# Altium project Y-Axis Driver.PrjPcb
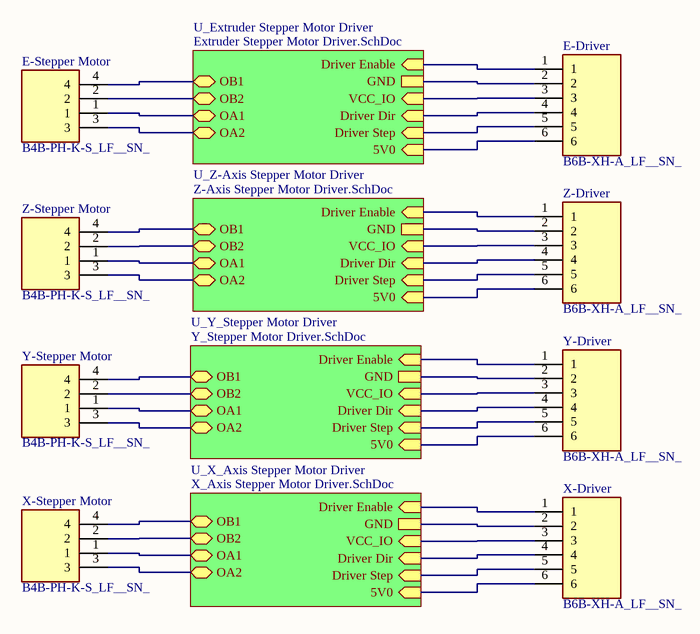
[diagram p0: Stepper Motor Driver Board.SchDoc]
4 sheets, 92 parts. Net scope: hierarchical (ports join the sheet entries above them; power ports are global).
Board file: Axis Driver PCB.PcbDoc
Sheets:
  Stepper Motor Driver Board.SchDoc
    U_X_Axis Stepper Motor Driver = X_Axis Stepper Motor Driver.SchDoc
    U_Z-Axis Stepper Motor Driver = Z-Axis Stepper Motor Driver.SchDoc
    U_Extruder Stepper Motor Driver = Extruder Stepper Motor Driver.SchDoc

## Sheet Stepper Motor Driver Board.SchDoc
size A; SheetNumber: 1; SheetTotal: 5

### Parts
E-Driver  B6B-XH-A_LF__SN_  [SHDR6W64P0X250_1X6_1740X575X700P]
E-Stepper_Motor  B4B-PH-K-S_LF__SN_  [SHDR4W50P0X200_1X4_990X450X600P]
X-Driver  B6B-XH-A_LF__SN_  [SHDR6W64P0X250_1X6_1740X575X700P]
X-Stepper_Motor  B4B-PH-K-S_LF__SN_  [SHDR4W50P0X200_1X4_990X450X600P]
Y-Driver  B6B-XH-A_LF__SN_  [SHDR6W64P0X250_1X6_1740X575X700P]
Y-Stepper_Motor  B4B-PH-K-S_LF__SN_  [SHDR4W50P0X200_1X4_990X450X600P]
Z-Driver  B6B-XH-A_LF__SN_  [SHDR6W64P0X250_1X6_1740X575X700P]
Z-Stepper_Motor  B4B-PH-K-S_LF__SN_  [SHDR4W50P0X200_1X4_990X450X600P]

### Sub-sheets
U_Extruder Stepper Motor Driver = Extruder Stepper Motor Driver.SchDoc: Driver Dir (in), Driver Step (in), Driver Enable (in), 5V0 (in), OB1 (bidir), OB2 (bidir), OA1 (bidir), OA2 (bidir), VCC_IO (in), GND
U_X_Axis Stepper Motor Driver = X_Axis Stepper Motor Driver.SchDoc: Driver Dir (in), Driver Step (in), Driver Enable (in), 5V0 (in), OB1 (bidir), OB2 (bidir), OA1 (bidir), OA2 (bidir), VCC_IO (in), GND
U_Y_Stepper Motor Driver = Y_Stepper Motor Driver.SchDoc (file not in this document): Driver Dir (in), Driver Step (in), Driver Enable (in), 5V0 (in), OB1 (bidir), OB2 (bidir), OA1 (bidir), OA2 (bidir), VCC_IO (in), GND
U_Z-Axis Stepper Motor Driver = Z-Axis Stepper Motor Driver.SchDoc: Driver Dir (in), Driver Step (in), Driver Enable (in), 5V0 (in), OB1 (bidir), OB2 (bidir), OA1 (bidir), OA2 (bidir), VCC_IO (in), GND

### Nets
Net0.47nF_X_1: X-Driver.6 ; sheet U_X_Axis Stepper Motor Driver/5V0
Net0.47nF_X_2: X-Driver.2 ; sheet U_X_Axis Stepper Motor Driver/GND
Net0.47nF_Z_1: Z-Driver.6 ; sheet U_Z-Axis Stepper Motor Driver/5V0
Net0.47nF_Z_2: Z-Driver.2 ; sheet U_Z-Axis Stepper Motor Driver/GND
Net0.47uF_E_1: E-Driver.6 ; sheet U_Extruder Stepper Motor Driver/5V0
Net0.47uF_E_2: E-Driver.2 ; sheet U_Extruder Stepper Motor Driver/GND
Net10k_Dr_Enb_E_2: E-Driver.1 ; sheet U_Extruder Stepper Motor Driver/Driver Enable
Net10k_Dr_Enb_X_2: X-Driver.1 ; sheet U_X_Axis Stepper Motor Driver/Driver Enable
Net10k_Dr_Enb_Z_2: Z-Driver.1 ; sheet U_Z-Axis Stepper Motor Driver/Driver Enable
Net100nF_1_E_2: E-Driver.3 ; sheet U_Extruder Stepper Motor Driver/VCC_IO
Net100nF_1_X_2: X-Driver.3 ; sheet U_X_Axis Stepper Motor Driver/VCC_IO
Net100nF_1_Z_2: Z-Driver.3 ; sheet U_Z-Axis Stepper Motor Driver/VCC_IO
NetE-Axis_SMIC_8: E-Driver.5 ; sheet U_Extruder Stepper Motor Driver/Driver Step
NetE-Axis_SMIC_9: E-Driver.4 ; sheet U_Extruder Stepper Motor Driver/Driver Dir
NetE-Axis_SMIC_15: E-Stepper_Motor.4 ; sheet U_Extruder Stepper Motor Driver/OB1
NetE-Axis_SMIC_19: E-Stepper_Motor.2 ; sheet U_Extruder Stepper Motor Driver/OB2
NetE-Axis_SMIC_42: E-Stepper_Motor.3 ; sheet U_Extruder Stepper Motor Driver/OA2
NetE-Axis_SMIC_46: E-Stepper_Motor.1 ; sheet U_Extruder Stepper Motor Driver/OA1
NetX-Axis_SMIC_8: X-Driver.5 ; sheet U_X_Axis Stepper Motor Driver/Driver Step
NetX-Axis_SMIC_9: X-Driver.4 ; sheet U_X_Axis Stepper Motor Driver/Driver Dir
NetX-Axis_SMIC_15: X-Stepper_Motor.4 ; sheet U_X_Axis Stepper Motor Driver/OB1
NetX-Axis_SMIC_19: X-Stepper_Motor.2 ; sheet U_X_Axis Stepper Motor Driver/OB2
NetX-Axis_SMIC_42: X-Stepper_Motor.3 ; sheet U_X_Axis Stepper Motor Driver/OA2
NetX-Axis_SMIC_46: X-Stepper_Motor.1 ; sheet U_X_Axis Stepper Motor Driver/OA1
NetY-Driver_1: Y-Driver.1 ; sheet U_Y_Stepper Motor Driver/Driver Enable
NetY-Driver_2: Y-Driver.2 ; sheet U_Y_Stepper Motor Driver/GND
NetY-Driver_3: Y-Driver.3 ; sheet U_Y_Stepper Motor Driver/VCC_IO
NetY-Driver_4: Y-Driver.4 ; sheet U_Y_Stepper Motor Driver/Driver Dir
NetY-Driver_5: Y-Driver.5 ; sheet U_Y_Stepper Motor Driver/Driver Step
NetY-Driver_6: Y-Driver.6 ; sheet U_Y_Stepper Motor Driver/5V0
NetY-Stepper_Motor_1: Y-Stepper_Motor.1 ; sheet U_Y_Stepper Motor Driver/OA1
NetY-Stepper_Motor_2: Y-Stepper_Motor.2 ; sheet U_Y_Stepper Motor Driver/OB2
NetY-Stepper_Motor_3: Y-Stepper_Motor.3 ; sheet U_Y_Stepper Motor Driver/OA2
NetY-Stepper_Motor_4: Y-Stepper_Motor.4 ; sheet U_Y_Stepper Motor Driver/OB1
NetZ-Axis_SMIC_8: Z-Driver.5 ; sheet U_Z-Axis Stepper Motor Driver/Driver Step
NetZ-Axis_SMIC_9: Z-Driver.4 ; sheet U_Z-Axis Stepper Motor Driver/Driver Dir
NetZ-Axis_SMIC_15: Z-Stepper_Motor.4 ; sheet U_Z-Axis Stepper Motor Driver/OB1
NetZ-Axis_SMIC_19: Z-Stepper_Motor.2 ; sheet U_Z-Axis Stepper Motor Driver/OB2
NetZ-Axis_SMIC_42: Z-Stepper_Motor.3 ; sheet U_Z-Axis Stepper Motor Driver/OA2
NetZ-Axis_SMIC_46: Z-Stepper_Motor.1 ; sheet U_Z-Axis Stepper Motor Driver/OA1

### Library data of the parts
E-Driver X-Driver Y-Driver Z-Driver = B6B-XH-A_LF__SN_: Connector; Manufacturer_Name: JST (JAPAN SOLDERLESS TERMINALS); Manufacturer_Part_Number: B6B-XH-A(LF)(SN); Datasheet Link: https://datasheet.lcsc.com/szlcsc/JST-Sales-America-B6B-XH-A-LF-SN_C144397.pdf; Height: 7mm; Arrow Part Number: B6B-XH-A(LF)(SN); Arrow Price/Stock: https://www.arrow.com/en/products/b6b-xh-a-lf-sn/jst-manufacturing?region=europe
E-Stepper_Motor X-Stepper_Motor Y-Stepper_Motor Z-Stepper_Motor = B4B-PH-K-S_LF__SN_: Connector; Manufacturer_Name: JST (JAPAN SOLDERLESS TERMINALS); Manufacturer_Part_Number: B4B-PH-K-S(LF)(SN); Datasheet Link: https://datasheet.lcsc.com/szlcsc/JST-Sales-America-B4B-PH-K-S-LF-SN_C131334.pdf; Height: 6mm; Arrow Part Number: B4B-PH-K-S(LF)(SN); Arrow Price/Stock: https://www.arrow.com/en/products/b4b-ph-k-s-lf-sn/jst-manufacturing

## Sheet X_Axis Stepper Motor Driver.SchDoc
size 300 x 299 mm; SheetNumber: 3; SheetTotal: 5
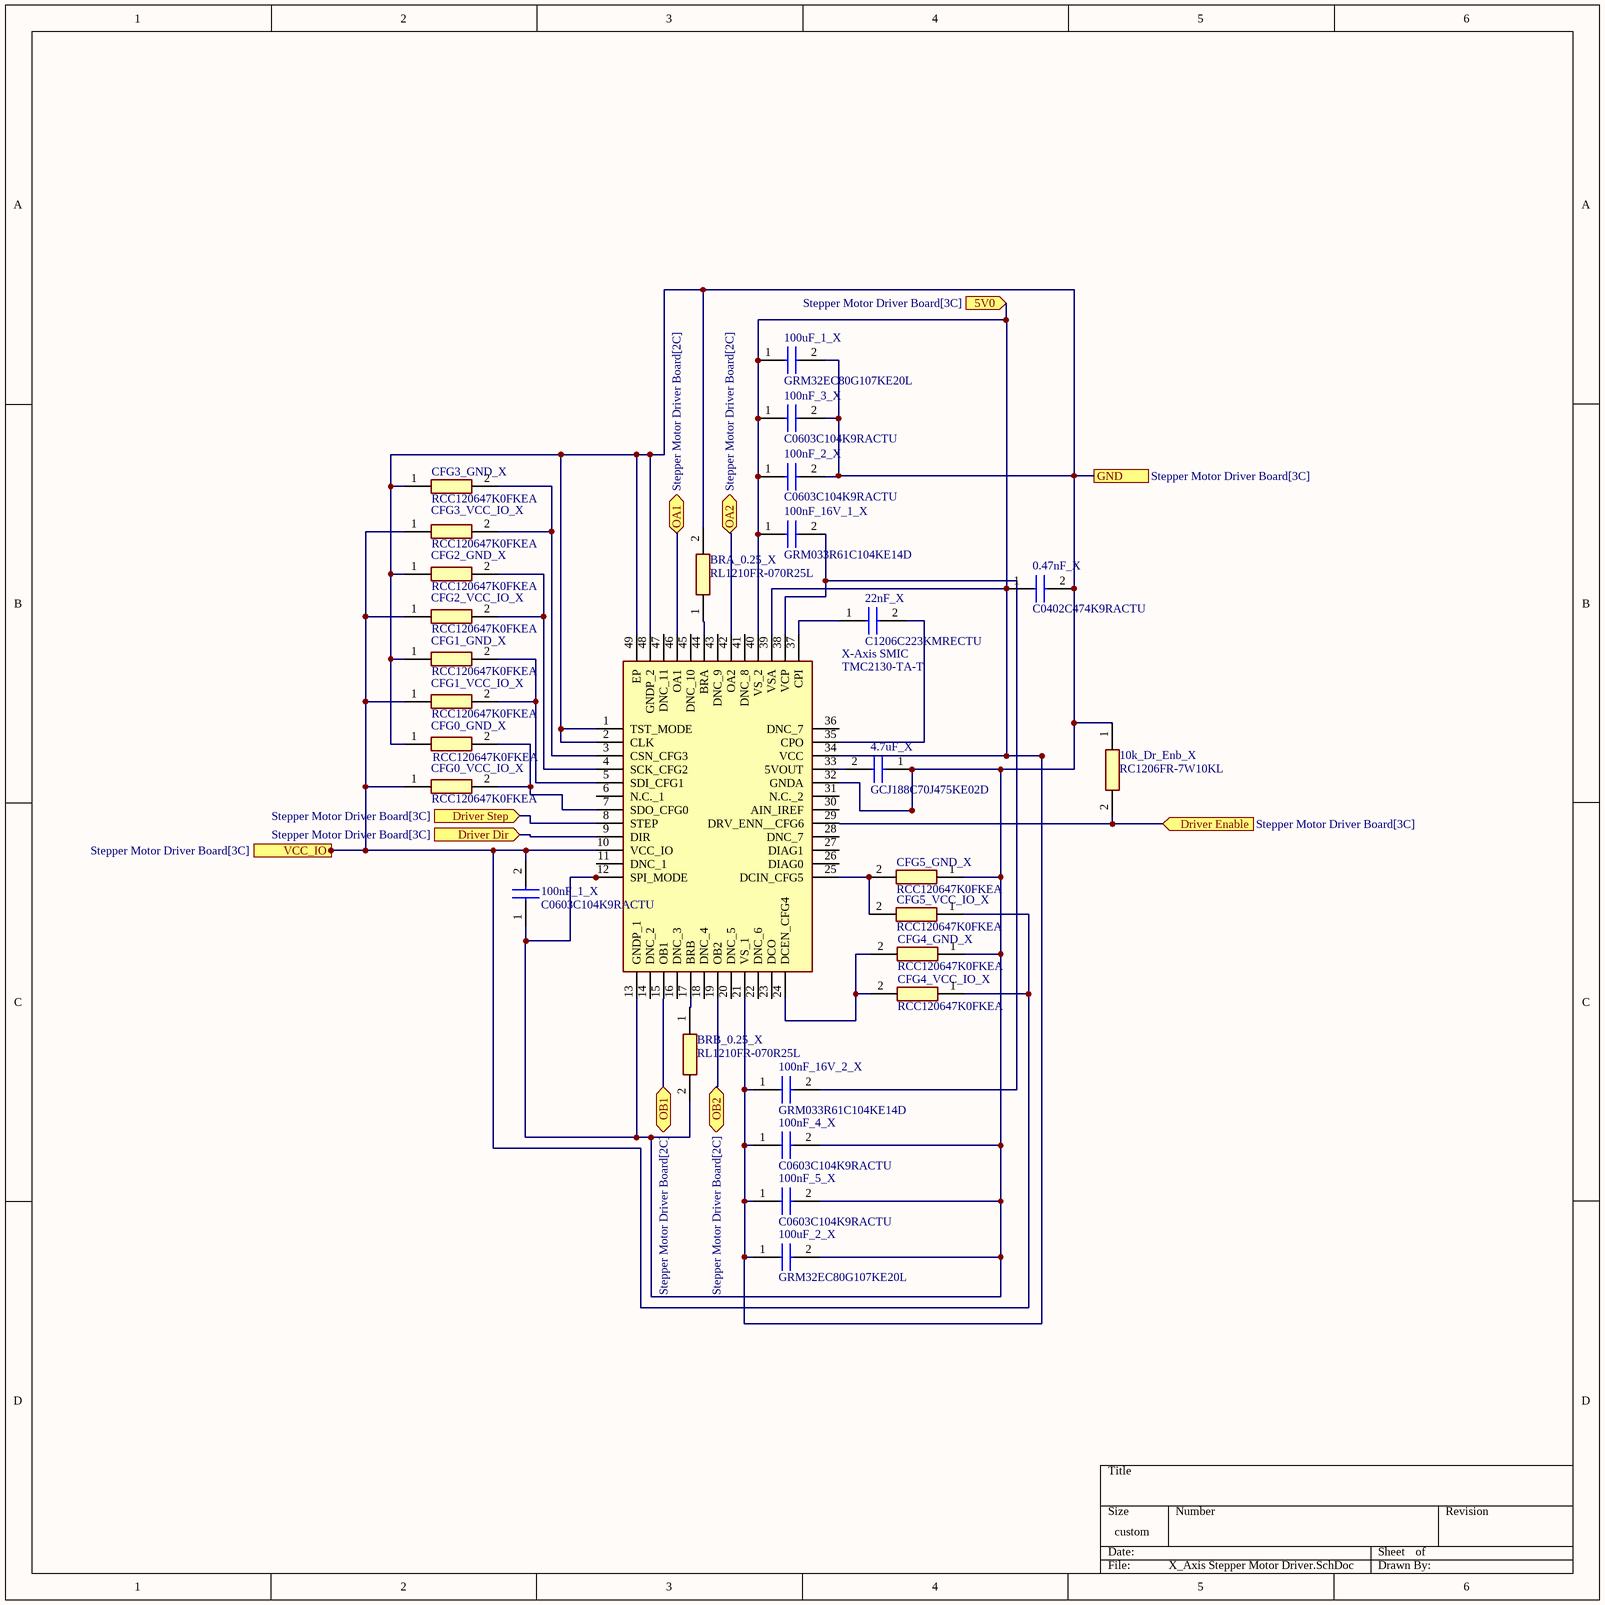
[diagram p1: X_Axis Stepper Motor Driver.SchDoc]

### Parts
0.47nF_X  C0402C474K9RACTU  [CAPC1005X55N]
4.7uF_X  GCJ188C70J475KE02D  [CAPC1608X100N]
10k_Dr_Enb_X  RC1206FR-7W10KL  [RESC3116X65N]
22nF_X  C1206C223KMRECTU  [C1206]
100nF_1_X  C0603C104K9RACTU  [C0603]
100nF_2_X  C0603C104K9RACTU  [C0603]
100nF_3_X  C0603C104K9RACTU  [C0603]
100nF_4_X  C0603C104K9RACTU  [C0603]
100nF_5_X  C0603C104K9RACTU  [C0603]
100nF_16V_1_X  GRM033R61C104KE14D  [CAPC0603X33N]
100nF_16V_2_X  GRM033R61C104KE14D  [CAPC0603X33N]
100uF_1_X  GRM32EC80G107KE20L  [CAPC3225X270N]
100uF_2_X  GRM32EC80G107KE20L  [CAPC3225X270N]
BRA_0.25_X  RL1210FR-070R25L  [RESC3126X65N]
BRB_0.25_X  RL1210FR-070R25L  [RESC3126X65N]
CFG0_GND_X  RCC120647K0FKEA  [RCC1206_e3]
CFG0_VCC_IO_X  RCC120647K0FKEA  [RCC1206_e3]
CFG1_GND_X  RCC120647K0FKEA  [RCC1206_e3]
CFG1_VCC_IO_X  RCC120647K0FKEA  [RCC1206_e3]
CFG2_GND_X  RCC120647K0FKEA  [RCC1206_e3]
CFG2_VCC_IO_X  RCC120647K0FKEA  [RCC1206_e3]
CFG3_GND_X  RCC120647K0FKEA  [RCC1206_e3]
CFG3_VCC_IO_X  RCC120647K0FKEA  [RCC1206_e3]
CFG4_GND_X  RCC120647K0FKEA  [RCC1206_e3]
CFG4_VCC_IO_X  RCC120647K0FKEA  [RCC1206_e3]
CFG5_GND_X  RCC120647K0FKEA  [RCC1206_e3]
CFG5_VCC_IO_X  RCC120647K0FKEA  [RCC1206_e3]
X-Axis_SMIC  TMC2130-TA-T  [QFP50P900X900X120-49N]

### Ports
5V0 (in, see Stepper Motor Driver Board[3C]), Driver Dir (in, see Stepper Motor Driver Board[3C]), Driver Enable (in, see Stepper Motor Driver Board[3C]), Driver Step (in, see Stepper Motor Driver Board[3C]), GND (see Stepper Motor Driver Board[3C]), OA1 (bidir, see Stepper Motor Driver Board[2C]), OA2 (bidir, see Stepper Motor Driver Board[2C]), OB1 (bidir, see Stepper Motor Driver Board[2C]), OB2 (bidir, see Stepper Motor Driver Board[2C]), VCC_IO (in, see Stepper Motor Driver Board[3C])

### Nets
Net0.47nF_X_1: 0.47nF_X.1 100nF_2_X.1 100nF_3_X.1 100nF_4_X.1 100nF_5_X.1 100nF_16V_1_X.1 100nF_16V_2_X.1 100uF_1_X.1 100uF_2_X.1 X-Axis_SMIC.21(VS_1) X-Axis_SMIC.34(VCC) X-Axis_SMIC.39(VSA) X-Axis_SMIC.40(VS_2) ; port 5V0
Net0.47nF_X_2: 0.47nF_X.2 4.7uF_X.1 10k_Dr_Enb_X.1 100nF_1_X.1 100nF_2_X.2 100nF_3_X.2 100nF_4_X.2 100nF_5_X.2 100uF_1_X.2 100uF_2_X.2 BRA_0.25_X.2 BRB_0.25_X.2 CFG0_GND_X.1 CFG1_GND_X.1 CFG2_GND_X.1 CFG3_GND_X.1 CFG4_GND_X.1 CFG5_GND_X.1 X-Axis_SMIC.1(TST_MODE) X-Axis_SMIC.2(CLK) X-Axis_SMIC.12(SPI_MODE) X-Axis_SMIC.13(GNDP_1) X-Axis_SMIC.32(GNDA) X-Axis_SMIC.48(GNDP_2) X-Axis_SMIC.49(EP) ; port GND
Net4.7uF_X_2: 4.7uF_X.2 X-Axis_SMIC.33(5VOUT)
Net10k_Dr_Enb_X_2: 10k_Dr_Enb_X.2 X-Axis_SMIC.29(DRV_ENN__CFG6) ; port Driver Enable
Net22nF_X_1: 22nF_X.1 X-Axis_SMIC.37(CPI)
Net22nF_X_2: 22nF_X.2 X-Axis_SMIC.35(CPO)
Net100nF_1_X_2: 100nF_1_X.2 CFG0_VCC_IO_X.1 CFG1_VCC_IO_X.1 CFG2_VCC_IO_X.1 CFG3_VCC_IO_X.1 CFG4_VCC_IO_X.1 CFG5_VCC_IO_X.1 X-Axis_SMIC.10(VCC_IO) ; port VCC_IO
Net100nF_16V_1_X_2: 100nF_16V_1_X.2 100nF_16V_2_X.2 X-Axis_SMIC.38(VCP)
NetBRA_0.25_X_1: BRA_0.25_X.1 X-Axis_SMIC.44(BRA)
NetBRB_0.25_X_1: BRB_0.25_X.1 X-Axis_SMIC.17(BRB)
NetCFG0_GND_X_2: CFG0_GND_X.2 CFG0_VCC_IO_X.2 X-Axis_SMIC.7(SDO_CFG0)
NetCFG1_GND_X_2: CFG1_GND_X.2 CFG1_VCC_IO_X.2 X-Axis_SMIC.5(SDI_CFG1)
NetCFG2_GND_X_2: CFG2_GND_X.2 CFG2_VCC_IO_X.2 X-Axis_SMIC.4(SCK_CFG2)
NetCFG3_GND_X_2: CFG3_GND_X.2 CFG3_VCC_IO_X.2 X-Axis_SMIC.3(CSN_CFG3)
NetCFG4_GND_X_2: CFG4_GND_X.2 CFG4_VCC_IO_X.2 X-Axis_SMIC.24(DCEN_CFG4)
NetCFG5_GND_X_2: CFG5_GND_X.2 CFG5_VCC_IO_X.2 X-Axis_SMIC.25(DCIN_CFG5)
NetX-Axis_SMIC_8: X-Axis_SMIC.8(STEP) ; port Driver Step
NetX-Axis_SMIC_9: X-Axis_SMIC.9(DIR) ; port Driver Dir
NetX-Axis_SMIC_15: X-Axis_SMIC.15(OB1) ; port OB1
NetX-Axis_SMIC_19: X-Axis_SMIC.19(OB2) ; port OB2
NetX-Axis_SMIC_42: X-Axis_SMIC.42(OA2) ; port OA2
NetX-Axis_SMIC_46: X-Axis_SMIC.46(OA1) ; port OA1

Not connected (* = marked no-connect by the designer): X-Axis_SMIC 6(N.C._1) 11(DNC_1) 14(DNC_2) 16(DNC_3) 18(DNC_4) 20(DNC_5) 22(DNC_6) 23(DCO) 26(DIAG0) 27(DIAG1) 28(DNC_7) 30(AIN_IREF) 31(N.C._2) 36(DNC_7) 41(DNC_8) 43(DNC_9) 45(DNC_10) 47(DNC_11)

### Library data of the parts
0.47nF_X = C0402C474K9RACTU: Capacitor; Manufacturer_Name: KEMET; Datasheet Link: https://content.kemet.com/datasheets/KEM_C1002_X7R_SMD.pdf; Height: 0.55mm; Manufacturer_Part_Number: C0402C474K9RACTU; Mouser Part Number: 80-C0402C474K9RACTU; Mouser Price/Stock: https://www.mouser.co.uk/ProductDetail/KEMET/C0402C474K9RACTU?qs=iLbezkQI%252BshEQvJDr%2FWmpQ%3D%3D
4.7uF_X = GCJ188C70J475KE02D: Capacitor; Manufacturer_Name: Murata Electronics; Datasheet Link: https://psearch.en.murata.com/capacitor/product/GCJ188C70J475KE02%23.html; Height: 1mm; Manufacturer_Part_Number: GCJ188C70J475KE02D; Mouser Part Number: 81-GCJ188C70J475KE2D; Mouser Price/Stock: https://www.mouser.co.uk/ProductDetail/Murata-Electronics/GCJ188C70J475KE02D?qs=QzBtWTOodeVfJR8CElrI4A%3D%3D; Arrow Part Number: GCJ188C70J475KE02D; Arrow Price/Stock: https://www.arrow.com/en/products/gcj188c70j475ke02d/murata-manufacturing?region=nac
10k_Dr_Enb_X = RC1206FR-7W10KL: Resistor; Manufacturer_Name: KEMET; Datasheet Link: https://datasheet.datasheetarchive.com/originals/distributors/Datasheets_SAMA/902f9e387b938f871d31120f5fc1d65e.pdf; Height: 0.65mm; Manufacturer_Part_Number: RC1206FR-7W10KL; Arrow Part Number: RC1206FR-7W10KL; Arrow Price/Stock: https://www.arrow.com/en/products/rc1206fr-7w10kl/yageo
22nF_X = C1206C223KMRECTU: Capacitor; Manufacturer_Name: KEMET; Datasheet Link: https://content.kemet.com/datasheets/KEM_C1090_X7R_ESD.pdf; Manufacturer_Part_Number: C1206C223KMRECTU; Mouser Part Number: 80-C1206C223KMRECTU; Mouser Price/Stock: https://www.mouser.co.uk/ProductDetail/KEMET/C1206C223KMRECTU?qs=55YtniHzbhA1XbH3T1d9uw%3D%3D
100nF_1_X 100nF_2_X 100nF_3_X 100nF_4_X 100nF_5_X = C0603C104K9RACTU: Capacitor; Manufacturer_Name: KEMET; Datasheet Link: https://content.kemet.com/datasheets/KEM_C1002_X7R_SMD.pdf; Height: 0.87mm; Manufacturer_Part_Number: C0603C104K9RACTU; Mouser Part Number: 80-C0603C104K9R; Mouser Price/Stock: https://www.mouser.co.uk/ProductDetail/KEMET/C0603C104K9RACTU?qs=7q2aiX3GdliuPZzPpldOsA%3D%3D; Arrow Part Number: C0603C104K9RACTU; Arrow Price/Stock: https://www.arrow.com/en/products/c0603c104k9ractu/kemet-corporation?region=nac
100nF_16V_1_X 100nF_16V_2_X = GRM033R61C104KE14D: Capacitor; Manufacturer_Name: Murata Electronics; Datasheet Link: https://psearch.en.murata.com/capacitor/product/GRM033R61C104KE14%23.html; Height: 0.33mm; Manufacturer_Part_Number: GRM033R61C104KE14D; Mouser Part Number: 81-GRM033R61C104KE4D; Mouser Price/Stock: https://www.mouser.co.uk/ProductDetail/Murata-Electronics/GRM033R61C104KE14D?qs=jHkklCh7amhDvY8zUHp0eA%3D%3D; Arrow Part Number: GRM033R61C104KE14D; Arrow Price/Stock: https://www.arrow.com/en/products/grm033r61c104ke14d/murata-manufacturing?region=nac
100uF_1_X 100uF_2_X = GRM32EC80G107KE20L: Capacitor; Manufacturer_Name: Murata Electronics; Datasheet Link: https://datasheet.datasheetarchive.com/originals/distributors/DKDS-10/192475.pdf; Height: 2.7mm; Manufacturer_Part_Number: GRM32EC80G107KE20L; Mouser Part Number: 81-GRM32EC80G107KE0L; Mouser Price/Stock: https://www.mouser.co.uk/ProductDetail/Murata-Electronics/GRM32EC80G107KE20L?qs=eeBpzGFlv%252B8VEtl0LRYzNQ%3D%3D; Arrow Part Number: GRM32EC80G107KE20L; Arrow Price/Stock: https://www.arrow.com/en/products/grm32ec80g107ke20l/murata-manufacturing
BRA_0.25_X BRB_0.25_X = RL1210FR-070R25L: Resistor; Manufacturer_Name: KEMET; Datasheet Link: https://www.mouser.de/datasheet/2/447/PYu-RL_Group_521_RoHS_L_2-1131815.pdf; Height: 0.65mm; Manufacturer_Part_Number: RL1210FR-070R25L; Mouser Part Number: 603-RL1210FR-070R25L; Mouser Price/Stock: https://www.mouser.co.uk/ProductDetail/Yageo/RL1210FR-070R25L?qs=k2KEx2DUIRR2Lho3B1zagg%3D%3D
CFG0_GND_X CFG0_VCC_IO_X CFG1_GND_X CFG1_VCC_IO_X CFG2_GND_X CFG2_VCC_IO_X CFG3_GND_X CFG3_VCC_IO_X CFG4_GND_X CFG4_VCC_IO_X CFG5_GND_X CFG5_VCC_IO_X = RCC120647K0FKEA: Resistor; Manufacturer_Name: Vishay; Datasheet Link: https://www.vishay.com/docs/20066/rcce3.pdf; Height: 0.6mm; Manufacturer_Part_Number: RCC120647K0FKEA; Mouser Part Number: 71-RCC120647K0FKEA; Mouser Price/Stock: https://www.mouser.co.uk/ProductDetail/Vishay-Dale/RCC120647K0FKEA?qs=IS%252B4QmGtzzrgga70d3fY5w%3D%3D
X-Axis_SMIC = TMC2130-TA-T: Integrated Circuit; Manufacturer_Name: TRINAMIC; Datasheet Link: https://www.trinamic.com/fileadmin/assets/Products/ICs_Documents/TMC2130_datasheet.pdf; Height: 1.2mm; Manufacturer_Part_Number: TMC2130-TA-T; Mouser Part Number: 700-TMC2130-TA-T; Mouser Price/Stock: https://www.mouser.co.uk/ProductDetail/Trinamic/TMC2130-TA-T?qs=TiOZkKH1s2SorQX5NhxZsQ%3D%3D

## Sheet Z-Axis Stepper Motor Driver.SchDoc
size 300 x 299 mm; SheetNumber: 4; SheetTotal: 5
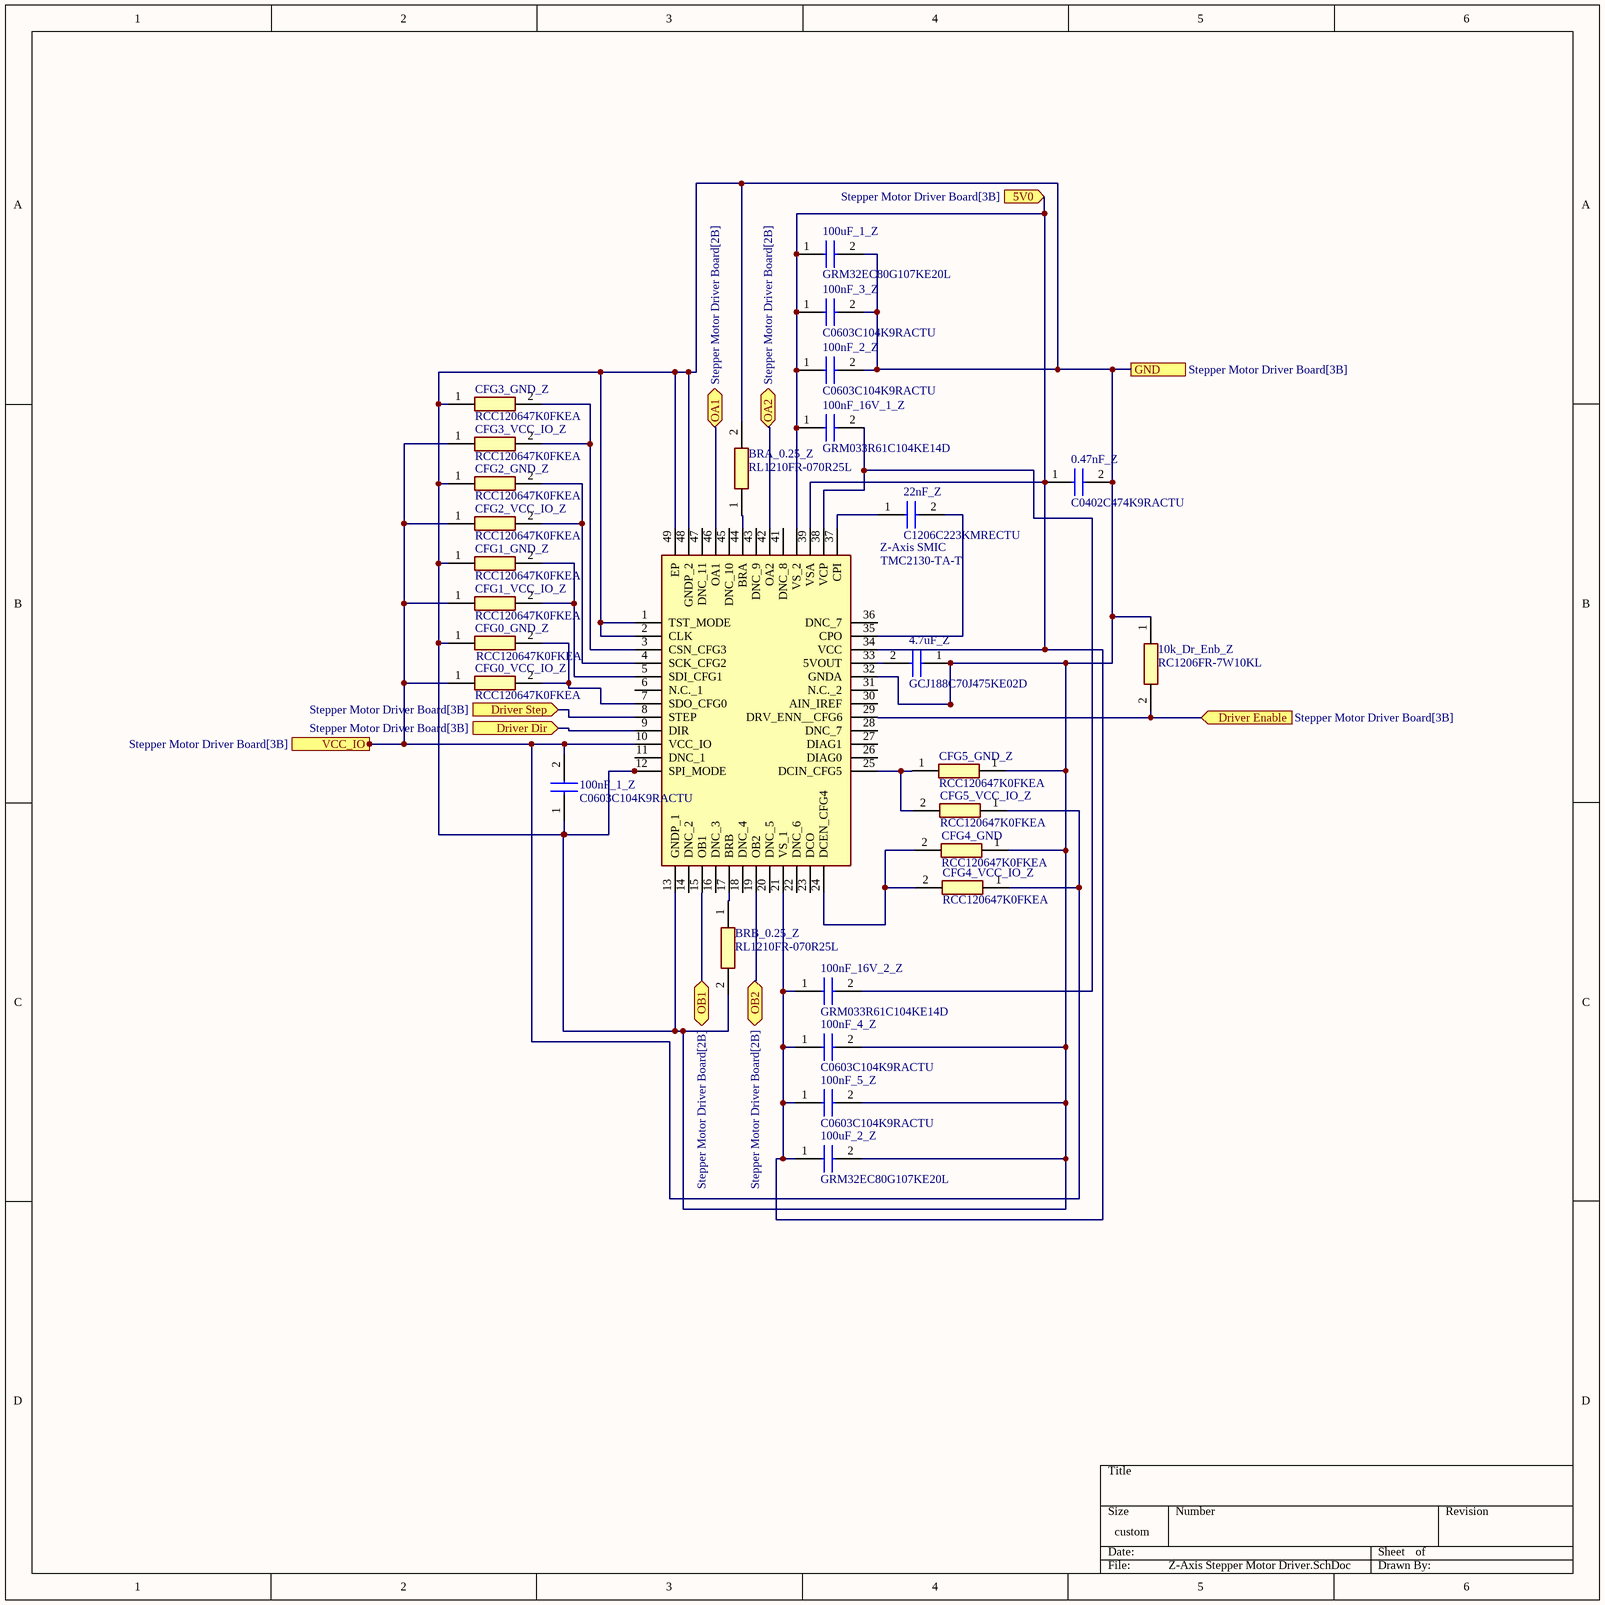
[diagram p2: Z-Axis Stepper Motor Driver.SchDoc]

### Parts
0.47nF_Z  C0402C474K9RACTU  [CAPC1005X55N]
4.7uF_Z  GCJ188C70J475KE02D  [CAPC1608X100N]
10k_Dr_Enb_Z  RC1206FR-7W10KL  [RESC3116X65N]
22nF_Z  C1206C223KMRECTU  [C1206]
100nF_1_Z  C0603C104K9RACTU  [C0603]
100nF_2_Z  C0603C104K9RACTU  [C0603]
100nF_3_Z  C0603C104K9RACTU  [C0603]
100nF_4_Z  C0603C104K9RACTU  [C0603]
100nF_5_Z  C0603C104K9RACTU  [C0603]
100nF_16V_1_Z  GRM033R61C104KE14D  [CAPC0603X33N]
100nF_16V_2_Z  GRM033R61C104KE14D  [CAPC0603X33N]
100uF_1_Z  GRM32EC80G107KE20L  [CAPC3225X270N]
100uF_2_Z  GRM32EC80G107KE20L  [CAPC3225X270N]
BRA_0.25_Z  RL1210FR-070R25L  [RESC3126X65N]
BRB_0.25_Z  RL1210FR-070R25L  [RESC3126X65N]
CFG0_GND_Z  RCC120647K0FKEA  [RCC1206_e3]
CFG0_VCC_IO_Z  RCC120647K0FKEA  [RCC1206_e3]
CFG1_GND_Z  RCC120647K0FKEA  [RCC1206_e3]
CFG1_VCC_IO_Z  RCC120647K0FKEA  [RCC1206_e3]
CFG2_GND_Z  RCC120647K0FKEA  [RCC1206_e3]
CFG2_VCC_IO_Z  RCC120647K0FKEA  [RCC1206_e3]
CFG3_GND_Z  RCC120647K0FKEA  [RCC1206_e3]
CFG3_VCC_IO_Z  RCC120647K0FKEA  [RCC1206_e3]
CFG4_GND  RCC120647K0FKEA  [RCC1206_e3]
CFG4_VCC_IO_Z  RCC120647K0FKEA  [RCC1206_e3]
CFG5_GND_Z  RCC120647K0FKEA  [RCC1206_e3]
CFG5_VCC_IO_Z  RCC120647K0FKEA  [RCC1206_e3]
Z-Axis_SMIC  TMC2130-TA-T  [QFP50P900X900X120-49N]

### Ports
5V0 (in, see Stepper Motor Driver Board[3B]), Driver Dir (in, see Stepper Motor Driver Board[3B]), Driver Enable (in, see Stepper Motor Driver Board[3B]), Driver Step (in, see Stepper Motor Driver Board[3B]), GND (see Stepper Motor Driver Board[3B]), OA1 (bidir, see Stepper Motor Driver Board[2B]), OA2 (bidir, see Stepper Motor Driver Board[2B]), OB1 (bidir, see Stepper Motor Driver Board[2B]), OB2 (bidir, see Stepper Motor Driver Board[2B]), VCC_IO (in, see Stepper Motor Driver Board[3B])

### Nets
Net0.47nF_Z_1: 0.47nF_Z.1 100nF_2_Z.1 100nF_3_Z.1 100nF_4_Z.1 100nF_5_Z.1 100nF_16V_1_Z.1 100nF_16V_2_Z.1 100uF_1_Z.1 100uF_2_Z.1 Z-Axis_SMIC.21(VS_1) Z-Axis_SMIC.34(VCC) Z-Axis_SMIC.39(VSA) Z-Axis_SMIC.40(VS_2) ; port 5V0
Net0.47nF_Z_2: 0.47nF_Z.2 4.7uF_Z.1 10k_Dr_Enb_Z.1 100nF_1_Z.1 100nF_2_Z.2 100nF_3_Z.2 100nF_4_Z.2 100nF_5_Z.2 100uF_1_Z.2 100uF_2_Z.2 BRA_0.25_Z.2 BRB_0.25_Z.2 CFG0_GND_Z.1 CFG1_GND_Z.1 CFG2_GND_Z.1 CFG3_GND_Z.1 CFG4_GND.1 CFG5_GND_Z.1 Z-Axis_SMIC.1(TST_MODE) Z-Axis_SMIC.2(CLK) Z-Axis_SMIC.12(SPI_MODE) Z-Axis_SMIC.13(GNDP_1) Z-Axis_SMIC.32(GNDA) Z-Axis_SMIC.48(GNDP_2) Z-Axis_SMIC.49(EP) ; port GND
Net4.7uF_Z_2: 4.7uF_Z.2 Z-Axis_SMIC.33(5VOUT)
Net10k_Dr_Enb_Z_2: 10k_Dr_Enb_Z.2 Z-Axis_SMIC.29(DRV_ENN__CFG6) ; port Driver Enable
Net22nF_Z_1: 22nF_Z.1 Z-Axis_SMIC.37(CPI)
Net22nF_Z_2: 22nF_Z.2 Z-Axis_SMIC.35(CPO)
Net100nF_1_Z_2: 100nF_1_Z.2 CFG0_VCC_IO_Z.1 CFG1_VCC_IO_Z.1 CFG2_VCC_IO_Z.1 CFG3_VCC_IO_Z.1 CFG4_VCC_IO_Z.1 CFG5_VCC_IO_Z.1 Z-Axis_SMIC.10(VCC_IO) ; port VCC_IO
Net100nF_16V_1_Z_2: 100nF_16V_1_Z.2 100nF_16V_2_Z.2 Z-Axis_SMIC.38(VCP)
NetBRA_0.25_Z_1: BRA_0.25_Z.1 Z-Axis_SMIC.44(BRA)
NetBRB_0.25_Z_1: BRB_0.25_Z.1 Z-Axis_SMIC.17(BRB)
NetCFG0_GND_Z_2: CFG0_GND_Z.2 CFG0_VCC_IO_Z.2 Z-Axis_SMIC.7(SDO_CFG0)
NetCFG1_GND_Z_2: CFG1_GND_Z.2 CFG1_VCC_IO_Z.2 Z-Axis_SMIC.5(SDI_CFG1)
NetCFG2_GND_Z_2: CFG2_GND_Z.2 CFG2_VCC_IO_Z.2 Z-Axis_SMIC.4(SCK_CFG2)
NetCFG3_GND_Z_2: CFG3_GND_Z.2 CFG3_VCC_IO_Z.2 Z-Axis_SMIC.3(CSN_CFG3)
NetCFG4_GND_2: CFG4_GND.2 CFG4_VCC_IO_Z.2 Z-Axis_SMIC.24(DCEN_CFG4)
NetCFG5_GND_Z_1: CFG5_GND_Z.1 CFG5_VCC_IO_Z.2 Z-Axis_SMIC.25(DCIN_CFG5)
NetZ-Axis_SMIC_8: Z-Axis_SMIC.8(STEP) ; port Driver Step
NetZ-Axis_SMIC_9: Z-Axis_SMIC.9(DIR) ; port Driver Dir
NetZ-Axis_SMIC_15: Z-Axis_SMIC.15(OB1) ; port OB1
NetZ-Axis_SMIC_19: Z-Axis_SMIC.19(OB2) ; port OB2
NetZ-Axis_SMIC_42: Z-Axis_SMIC.42(OA2) ; port OA2
NetZ-Axis_SMIC_46: Z-Axis_SMIC.46(OA1) ; port OA1

Not connected (* = marked no-connect by the designer): Z-Axis_SMIC 6(N.C._1) 11(DNC_1) 14(DNC_2) 16(DNC_3) 18(DNC_4) 20(DNC_5) 22(DNC_6) 23(DCO) 26(DIAG0) 27(DIAG1) 28(DNC_7) 30(AIN_IREF) 31(N.C._2) 36(DNC_7) 41(DNC_8) 43(DNC_9) 45(DNC_10) 47(DNC_11)

### Library data of the parts
0.47nF_Z = C0402C474K9RACTU: Capacitor; Manufacturer_Name: KEMET; Datasheet Link: https://content.kemet.com/datasheets/KEM_C1002_X7R_SMD.pdf; Height: 0.55mm; Manufacturer_Part_Number: C0402C474K9RACTU; Mouser Part Number: 80-C0402C474K9RACTU; Mouser Price/Stock: https://www.mouser.co.uk/ProductDetail/KEMET/C0402C474K9RACTU?qs=iLbezkQI%252BshEQvJDr%2FWmpQ%3D%3D
4.7uF_Z = GCJ188C70J475KE02D: as 4.7uF_X on sheet X_Axis Stepper Motor Driver; Datasheet Link: https://psearch.en.murata.com/capacitor/product/GCJ188C70J475KE02%23.html; Height: 1mm; Manufacturer_Part_Number: GCJ188C70J475KE02D; Mouser Part Number: 81-GCJ188C70J475KE2D; Mouser Price/Stock: https://www.mouser.co.uk/ProductDetail/Murata-Electronics/GCJ188C70J475KE02D?qs=QzBtWTOodeVfJR8CElrI4A%3D%3D; Arrow Part Number: GCJ188C70J475KE02D; Arrow Price/Stock: https://www.arrow.com/en/products/gcj188c70j475ke02d/murata-manufacturing?region=nac
10k_Dr_Enb_Z = RC1206FR-7W10KL: Resistor; Manufacturer_Name: KEMET; Datasheet Link: https://datasheet.datasheetarchive.com/originals/distributors/Datasheets_SAMA/902f9e387b938f871d31120f5fc1d65e.pdf; Height: 0.65mm; Manufacturer_Part_Number: RC1206FR-7W10KL; Arrow Part Number: RC1206FR-7W10KL; Arrow Price/Stock: https://www.arrow.com/en/products/rc1206fr-7w10kl/yageo
22nF_Z = C1206C223KMRECTU: Capacitor; Manufacturer_Name: KEMET; Datasheet Link: https://content.kemet.com/datasheets/KEM_C1090_X7R_ESD.pdf; Manufacturer_Part_Number: C1206C223KMRECTU; Mouser Part Number: 80-C1206C223KMRECTU; Mouser Price/Stock: https://www.mouser.co.uk/ProductDetail/KEMET/C1206C223KMRECTU?qs=55YtniHzbhA1XbH3T1d9uw%3D%3D
100nF_1_Z 100nF_2_Z 100nF_3_Z 100nF_4_Z 100nF_5_Z = C0603C104K9RACTU: Capacitor; Manufacturer_Name: KEMET; Datasheet Link: https://content.kemet.com/datasheets/KEM_C1002_X7R_SMD.pdf; Height: 0.87mm; Manufacturer_Part_Number: C0603C104K9RACTU; Mouser Part Number: 80-C0603C104K9R; Mouser Price/Stock: https://www.mouser.co.uk/ProductDetail/KEMET/C0603C104K9RACTU?qs=7q2aiX3GdliuPZzPpldOsA%3D%3D; Arrow Part Number: C0603C104K9RACTU; Arrow Price/Stock: https://www.arrow.com/en/products/c0603c104k9ractu/kemet-corporation?region=nac
100nF_16V_1_Z 100nF_16V_2_Z = GRM033R61C104KE14D: as 100nF_16V_1_X on sheet X_Axis Stepper Motor Driver; Datasheet Link: https://psearch.en.murata.com/capacitor/product/GRM033R61C104KE14%23.html; Height: 0.33mm; Manufacturer_Part_Number: GRM033R61C104KE14D; Mouser Part Number: 81-GRM033R61C104KE4D; Mouser Price/Stock: https://www.mouser.co.uk/ProductDetail/Murata-Electronics/GRM033R61C104KE14D?qs=jHkklCh7amhDvY8zUHp0eA%3D%3D; Arrow Part Number: GRM033R61C104KE14D; Arrow Price/Stock: https://www.arrow.com/en/products/grm033r61c104ke14d/murata-manufacturing?region=nac
100uF_1_Z 100uF_2_Z = GRM32EC80G107KE20L: as 100uF_1_X on sheet X_Axis Stepper Motor Driver; Datasheet Link: https://datasheet.datasheetarchive.com/originals/distributors/DKDS-10/192475.pdf; Height: 2.7mm; Manufacturer_Part_Number: GRM32EC80G107KE20L; Mouser Part Number: 81-GRM32EC80G107KE0L; Mouser Price/Stock: https://www.mouser.co.uk/ProductDetail/Murata-Electronics/GRM32EC80G107KE20L?qs=eeBpzGFlv%252B8VEtl0LRYzNQ%3D%3D; Arrow Part Number: GRM32EC80G107KE20L; Arrow Price/Stock: https://www.arrow.com/en/products/grm32ec80g107ke20l/murata-manufacturing
BRA_0.25_Z BRB_0.25_Z = RL1210FR-070R25L: Resistor; Manufacturer_Name: KEMET; Datasheet Link: https://www.mouser.de/datasheet/2/447/PYu-RL_Group_521_RoHS_L_2-1131815.pdf; Height: 0.65mm; Manufacturer_Part_Number: RL1210FR-070R25L; Mouser Part Number: 603-RL1210FR-070R25L; Mouser Price/Stock: https://www.mouser.co.uk/ProductDetail/Yageo/RL1210FR-070R25L?qs=k2KEx2DUIRR2Lho3B1zagg%3D%3D
CFG0_GND_Z CFG0_VCC_IO_Z CFG1_GND_Z CFG1_VCC_IO_Z CFG2_GND_Z CFG2_VCC_IO_Z CFG3_GND_Z CFG3_VCC_IO_Z CFG4_GND CFG4_VCC_IO_Z CFG5_GND_Z CFG5_VCC_IO_Z = RCC120647K0FKEA: Resistor; Manufacturer_Name: Vishay; Datasheet Link: https://www.vishay.com/docs/20066/rcce3.pdf; Height: 0.6mm; Manufacturer_Part_Number: RCC120647K0FKEA; Mouser Part Number: 71-RCC120647K0FKEA; Mouser Price/Stock: https://www.mouser.co.uk/ProductDetail/Vishay-Dale/RCC120647K0FKEA?qs=IS%252B4QmGtzzrgga70d3fY5w%3D%3D
Z-Axis_SMIC = TMC2130-TA-T: as X-Axis_SMIC on sheet X_Axis Stepper Motor Driver; Datasheet Link: https://www.trinamic.com/fileadmin/assets/Products/ICs_Documents/TMC2130_datasheet.pdf; Height: 1.2mm; Manufacturer_Part_Number: TMC2130-TA-T; Mouser Part Number: 700-TMC2130-TA-T; Mouser Price/Stock: https://www.mouser.co.uk/ProductDetail/Trinamic/TMC2130-TA-T?qs=TiOZkKH1s2SorQX5NhxZsQ%3D%3D

## Sheet Extruder Stepper Motor Driver.SchDoc
size 300 x 299 mm; SheetNumber: 5; SheetTotal: 5
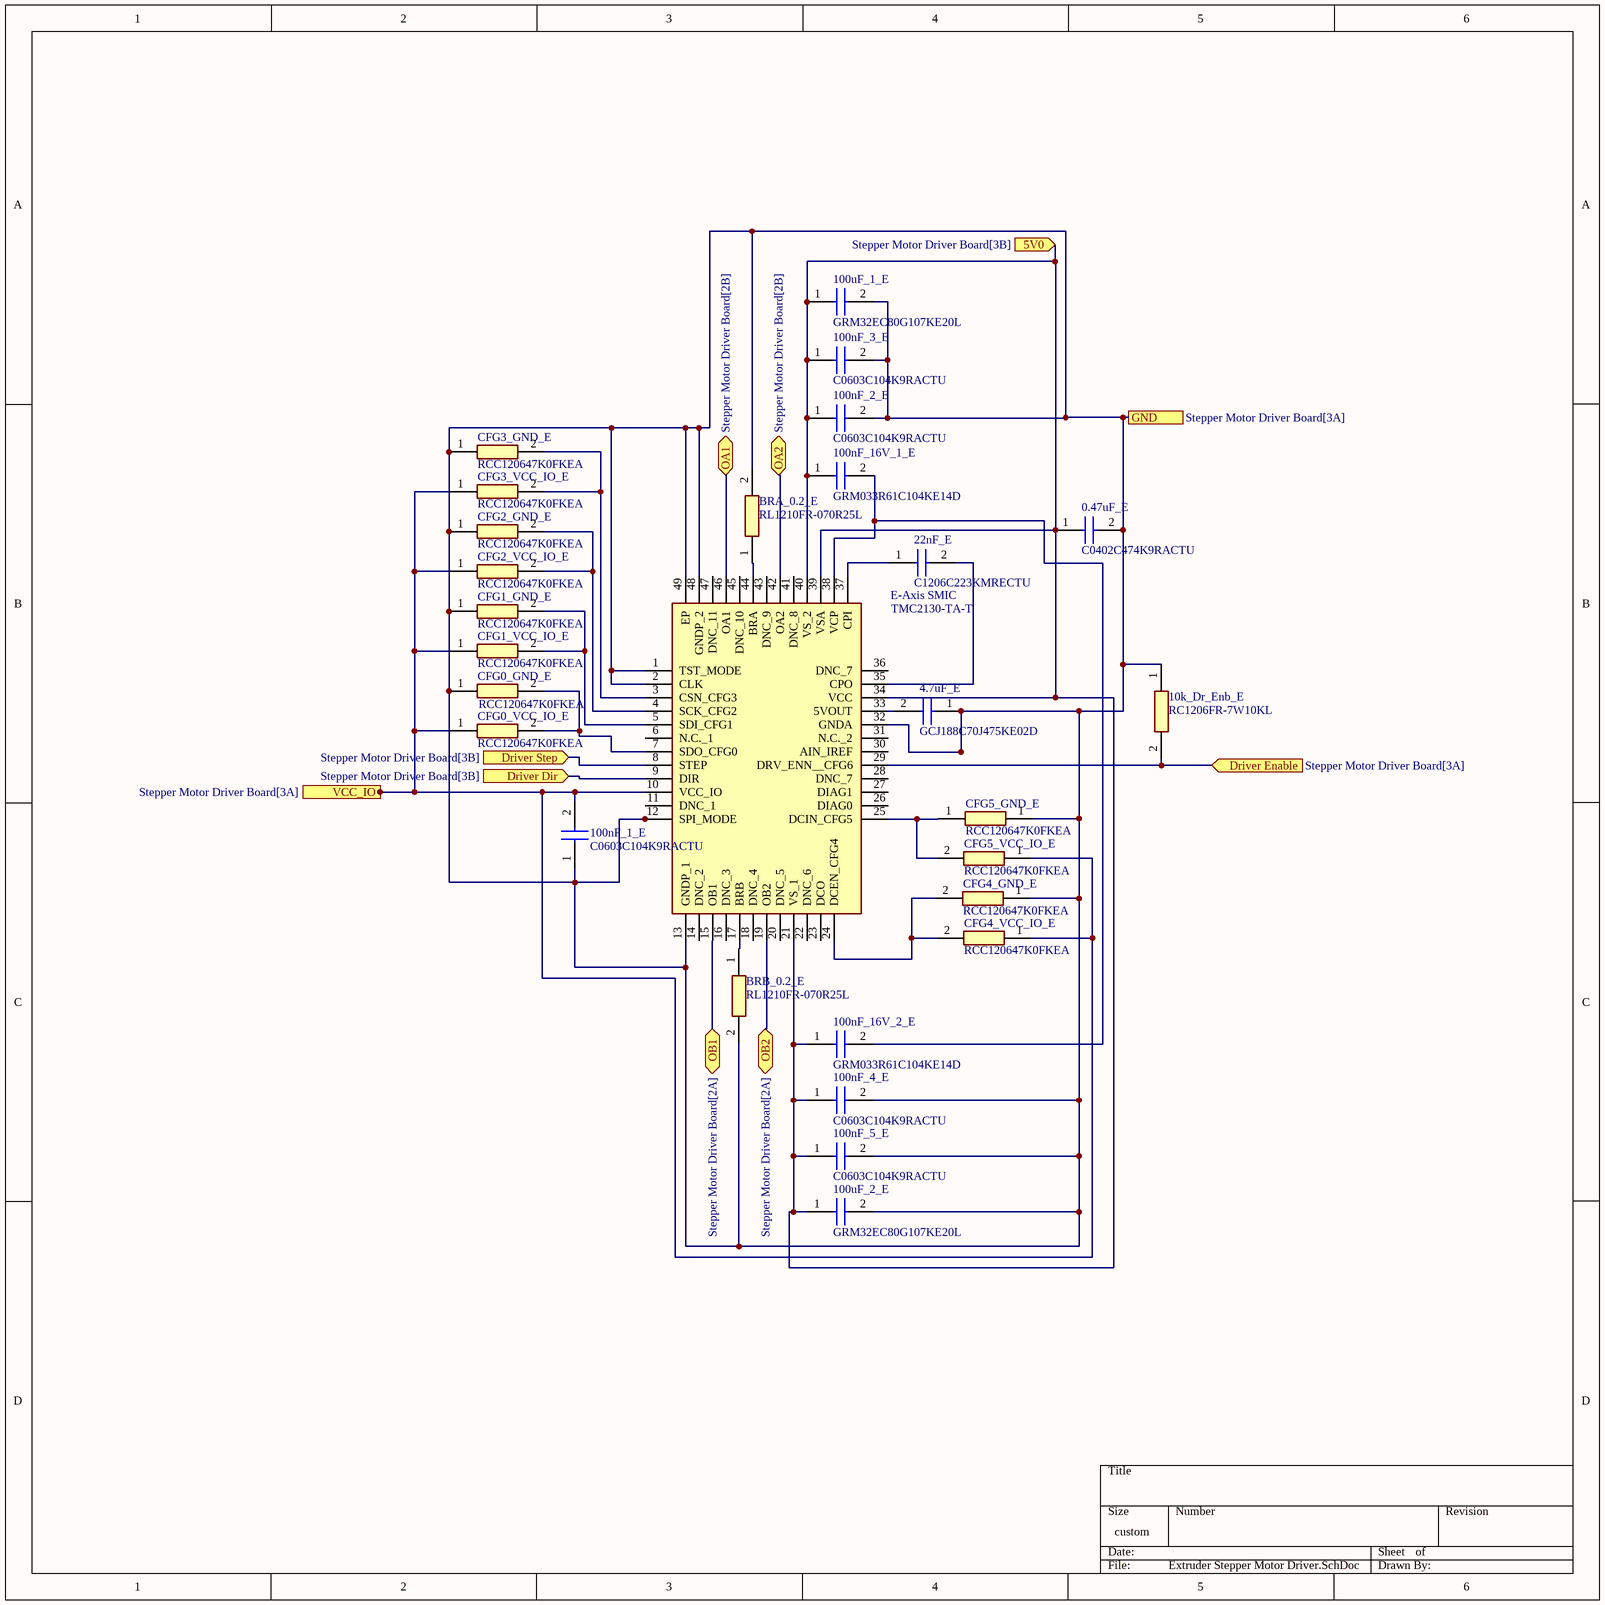
[diagram p3: Extruder Stepper Motor Driver.SchDoc]

### Parts
0.47uF_E  C0402C474K9RACTU  [CAPC1005X55N]
4.7uF_E  GCJ188C70J475KE02D  [CAPC1608X100N]
10k_Dr_Enb_E  RC1206FR-7W10KL  [RESC3116X65N]
22nF_E  C1206C223KMRECTU  [C1206]
100nF_1_E  C0603C104K9RACTU  [C0603]
100nF_2_E  C0603C104K9RACTU  [C0603]
100nF_3_E  C0603C104K9RACTU  [C0603]
100nF_4_E  C0603C104K9RACTU  [C0603]
100nF_5_E  C0603C104K9RACTU  [C0603]
100nF_16V_1_E  GRM033R61C104KE14D  [CAPC0603X33N]
100nF_16V_2_E  GRM033R61C104KE14D  [CAPC0603X33N]
100uF_1_E  GRM32EC80G107KE20L  [CAPC3225X270N]
100uF_2_E  GRM32EC80G107KE20L  [CAPC3225X270N]
BRA_0.2_E  RL1210FR-070R25L  [RESC3126X65N]
BRB_0.2_E  RL1210FR-070R25L  [RESC3126X65N]
CFG0_GND_E  RCC120647K0FKEA  [RCC1206_e3]
CFG0_VCC_IO_E  RCC120647K0FKEA  [RCC1206_e3]
CFG1_GND_E  RCC120647K0FKEA  [RCC1206_e3]
CFG1_VCC_IO_E  RCC120647K0FKEA  [RCC1206_e3]
CFG2_GND_E  RCC120647K0FKEA  [RCC1206_e3]
CFG2_VCC_IO_E  RCC120647K0FKEA  [RCC1206_e3]
CFG3_GND_E  RCC120647K0FKEA  [RCC1206_e3]
CFG3_VCC_IO_E  RCC120647K0FKEA  [RCC1206_e3]
CFG4_GND_E  RCC120647K0FKEA  [RCC1206_e3]
CFG4_VCC_IO_E  RCC120647K0FKEA  [RCC1206_e3]
CFG5_GND_E  RCC120647K0FKEA  [RCC1206_e3]
CFG5_VCC_IO_E  RCC120647K0FKEA  [RCC1206_e3]
E-Axis_SMIC  TMC2130-TA-T  [QFP50P900X900X120-49N]

### Ports
5V0 (in, see Stepper Motor Driver Board[3B]), Driver Dir (in, see Stepper Motor Driver Board[3B]), Driver Enable (in, see Stepper Motor Driver Board[3A]), Driver Step (in, see Stepper Motor Driver Board[3B]), GND (see Stepper Motor Driver Board[3A]), OA1 (bidir, see Stepper Motor Driver Board[2B]), OA2 (bidir, see Stepper Motor Driver Board[2B]), OB1 (bidir, see Stepper Motor Driver Board[2A]), OB2 (bidir, see Stepper Motor Driver Board[2A]), VCC_IO (in, see Stepper Motor Driver Board[3A])

### Nets
Net0.47uF_E_1: 0.47uF_E.1 100nF_2_E.1 100nF_3_E.1 100nF_4_E.1 100nF_5_E.1 100nF_16V_1_E.1 100nF_16V_2_E.1 100uF_1_E.1 100uF_2_E.1 E-Axis_SMIC.21(VS_1) E-Axis_SMIC.34(VCC) E-Axis_SMIC.39(VSA) E-Axis_SMIC.40(VS_2) ; port 5V0
Net0.47uF_E_2: 0.47uF_E.2 4.7uF_E.1 10k_Dr_Enb_E.1 100nF_1_E.1 100nF_2_E.2 100nF_3_E.2 100nF_4_E.2 100nF_5_E.2 100uF_1_E.2 100uF_2_E.2 BRA_0.2_E.2 BRB_0.2_E.2 CFG0_GND_E.1 CFG1_GND_E.1 CFG2_GND_E.1 CFG3_GND_E.1 CFG4_GND_E.1 CFG5_GND_E.1 E-Axis_SMIC.1(TST_MODE) E-Axis_SMIC.2(CLK) E-Axis_SMIC.12(SPI_MODE) E-Axis_SMIC.13(GNDP_1) E-Axis_SMIC.32(GNDA) E-Axis_SMIC.48(GNDP_2) E-Axis_SMIC.49(EP) ; port GND
Net4.7uF_E_2: 4.7uF_E.2 E-Axis_SMIC.33(5VOUT)
Net10k_Dr_Enb_E_2: 10k_Dr_Enb_E.2 E-Axis_SMIC.29(DRV_ENN__CFG6) ; port Driver Enable
Net22nF_E_1: 22nF_E.1 E-Axis_SMIC.37(CPI)
Net22nF_E_2: 22nF_E.2 E-Axis_SMIC.35(CPO)
Net100nF_1_E_2: 100nF_1_E.2 CFG0_VCC_IO_E.1 CFG1_VCC_IO_E.1 CFG2_VCC_IO_E.1 CFG3_VCC_IO_E.1 CFG4_VCC_IO_E.1 CFG5_VCC_IO_E.1 E-Axis_SMIC.10(VCC_IO) ; port VCC_IO
Net100nF_16V_1_E_2: 100nF_16V_1_E.2 100nF_16V_2_E.2 E-Axis_SMIC.38(VCP)
NetBRA_0.2_E_1: BRA_0.2_E.1 E-Axis_SMIC.44(BRA)
NetBRB_0.2_E_1: BRB_0.2_E.1 E-Axis_SMIC.17(BRB)
NetCFG0_GND_E_2: CFG0_GND_E.2 CFG0_VCC_IO_E.2 E-Axis_SMIC.7(SDO_CFG0)
NetCFG1_GND_E_2: CFG1_GND_E.2 CFG1_VCC_IO_E.2 E-Axis_SMIC.5(SDI_CFG1)
NetCFG2_GND_E_2: CFG2_GND_E.2 CFG2_VCC_IO_E.2 E-Axis_SMIC.4(SCK_CFG2)
NetCFG3_GND_E_2: CFG3_GND_E.2 CFG3_VCC_IO_E.2 E-Axis_SMIC.3(CSN_CFG3)
NetCFG4_GND_E_2: CFG4_GND_E.2 CFG4_VCC_IO_E.2 E-Axis_SMIC.24(DCEN_CFG4)
NetCFG5_GND_E_1: CFG5_GND_E.1 CFG5_VCC_IO_E.2 E-Axis_SMIC.25(DCIN_CFG5)
NetE-Axis_SMIC_8: E-Axis_SMIC.8(STEP) ; port Driver Step
NetE-Axis_SMIC_9: E-Axis_SMIC.9(DIR) ; port Driver Dir
NetE-Axis_SMIC_15: E-Axis_SMIC.15(OB1) ; port OB1
NetE-Axis_SMIC_19: E-Axis_SMIC.19(OB2) ; port OB2
NetE-Axis_SMIC_42: E-Axis_SMIC.42(OA2) ; port OA2
NetE-Axis_SMIC_46: E-Axis_SMIC.46(OA1) ; port OA1

Not connected (* = marked no-connect by the designer): E-Axis_SMIC 6(N.C._1) 11(DNC_1) 14(DNC_2) 16(DNC_3) 18(DNC_4) 20(DNC_5) 22(DNC_6) 23(DCO) 26(DIAG0) 27(DIAG1) 28(DNC_7) 30(AIN_IREF) 31(N.C._2) 36(DNC_7) 41(DNC_8) 43(DNC_9) 45(DNC_10) 47(DNC_11)

### Library data of the parts
0.47uF_E = C0402C474K9RACTU: Capacitor; Manufacturer_Name: KEMET; Datasheet Link: https://content.kemet.com/datasheets/KEM_C1002_X7R_SMD.pdf; Height: 0.55mm; Manufacturer_Part_Number: C0402C474K9RACTU; Mouser Part Number: 80-C0402C474K9RACTU; Mouser Price/Stock: https://www.mouser.co.uk/ProductDetail/KEMET/C0402C474K9RACTU?qs=iLbezkQI%252BshEQvJDr%2FWmpQ%3D%3D
4.7uF_E = GCJ188C70J475KE02D: as 4.7uF_X on sheet X_Axis Stepper Motor Driver; Datasheet Link: https://psearch.en.murata.com/capacitor/product/GCJ188C70J475KE02%23.html; Height: 1mm; Manufacturer_Part_Number: GCJ188C70J475KE02D; Mouser Part Number: 81-GCJ188C70J475KE2D; Mouser Price/Stock: https://www.mouser.co.uk/ProductDetail/Murata-Electronics/GCJ188C70J475KE02D?qs=QzBtWTOodeVfJR8CElrI4A%3D%3D; Arrow Part Number: GCJ188C70J475KE02D; Arrow Price/Stock: https://www.arrow.com/en/products/gcj188c70j475ke02d/murata-manufacturing?region=nac
10k_Dr_Enb_E = RC1206FR-7W10KL: Resistor; Manufacturer_Name: KEMET; Datasheet Link: https://datasheet.datasheetarchive.com/originals/distributors/Datasheets_SAMA/902f9e387b938f871d31120f5fc1d65e.pdf; Height: 0.65mm; Manufacturer_Part_Number: RC1206FR-7W10KL; Arrow Part Number: RC1206FR-7W10KL; Arrow Price/Stock: https://www.arrow.com/en/products/rc1206fr-7w10kl/yageo
22nF_E = C1206C223KMRECTU: Capacitor; Manufacturer_Name: KEMET; Datasheet Link: https://content.kemet.com/datasheets/KEM_C1090_X7R_ESD.pdf; Manufacturer_Part_Number: C1206C223KMRECTU; Mouser Part Number: 80-C1206C223KMRECTU; Mouser Price/Stock: https://www.mouser.co.uk/ProductDetail/KEMET/C1206C223KMRECTU?qs=55YtniHzbhA1XbH3T1d9uw%3D%3D
100nF_1_E 100nF_2_E 100nF_3_E 100nF_4_E 100nF_5_E = C0603C104K9RACTU: Capacitor; Manufacturer_Name: KEMET; Datasheet Link: https://content.kemet.com/datasheets/KEM_C1002_X7R_SMD.pdf; Height: 0.87mm; Manufacturer_Part_Number: C0603C104K9RACTU; Mouser Part Number: 80-C0603C104K9R; Mouser Price/Stock: https://www.mouser.co.uk/ProductDetail/KEMET/C0603C104K9RACTU?qs=7q2aiX3GdliuPZzPpldOsA%3D%3D; Arrow Part Number: C0603C104K9RACTU; Arrow Price/Stock: https://www.arrow.com/en/products/c0603c104k9ractu/kemet-corporation?region=nac
100nF_16V_1_E 100nF_16V_2_E = GRM033R61C104KE14D: as 100nF_16V_1_X on sheet X_Axis Stepper Motor Driver; Datasheet Link: https://psearch.en.murata.com/capacitor/product/GRM033R61C104KE14%23.html; Height: 0.33mm; Manufacturer_Part_Number: GRM033R61C104KE14D; Mouser Part Number: 81-GRM033R61C104KE4D; Mouser Price/Stock: https://www.mouser.co.uk/ProductDetail/Murata-Electronics/GRM033R61C104KE14D?qs=jHkklCh7amhDvY8zUHp0eA%3D%3D; Arrow Part Number: GRM033R61C104KE14D; Arrow Price/Stock: https://www.arrow.com/en/products/grm033r61c104ke14d/murata-manufacturing?region=nac
100uF_1_E 100uF_2_E = GRM32EC80G107KE20L: as 100uF_1_X on sheet X_Axis Stepper Motor Driver; Datasheet Link: https://datasheet.datasheetarchive.com/originals/distributors/DKDS-10/192475.pdf; Height: 2.7mm; Manufacturer_Part_Number: GRM32EC80G107KE20L; Mouser Part Number: 81-GRM32EC80G107KE0L; Mouser Price/Stock: https://www.mouser.co.uk/ProductDetail/Murata-Electronics/GRM32EC80G107KE20L?qs=eeBpzGFlv%252B8VEtl0LRYzNQ%3D%3D; Arrow Part Number: GRM32EC80G107KE20L; Arrow Price/Stock: https://www.arrow.com/en/products/grm32ec80g107ke20l/murata-manufacturing
BRA_0.2_E BRB_0.2_E = RL1210FR-070R25L: Resistor; Manufacturer_Name: KEMET; Datasheet Link: https://www.mouser.de/datasheet/2/447/PYu-RL_Group_521_RoHS_L_2-1131815.pdf; Height: 0.65mm; Manufacturer_Part_Number: RL1210FR-070R25L; Mouser Part Number: 603-RL1210FR-070R25L; Mouser Price/Stock: https://www.mouser.co.uk/ProductDetail/Yageo/RL1210FR-070R25L?qs=k2KEx2DUIRR2Lho3B1zagg%3D%3D
CFG0_GND_E CFG0_VCC_IO_E CFG1_GND_E CFG1_VCC_IO_E CFG2_GND_E CFG2_VCC_IO_E CFG3_GND_E CFG3_VCC_IO_E CFG4_GND_E CFG4_VCC_IO_E CFG5_GND_E CFG5_VCC_IO_E = RCC120647K0FKEA: Resistor; Manufacturer_Name: Vishay; Datasheet Link: https://www.vishay.com/docs/20066/rcce3.pdf; Height: 0.6mm; Manufacturer_Part_Number: RCC120647K0FKEA; Mouser Part Number: 71-RCC120647K0FKEA; Mouser Price/Stock: https://www.mouser.co.uk/ProductDetail/Vishay-Dale/RCC120647K0FKEA?qs=IS%252B4QmGtzzrgga70d3fY5w%3D%3D
E-Axis_SMIC = TMC2130-TA-T: as X-Axis_SMIC on sheet X_Axis Stepper Motor Driver; Datasheet Link: https://www.trinamic.com/fileadmin/assets/Products/ICs_Documents/TMC2130_datasheet.pdf; Height: 1.2mm; Manufacturer_Part_Number: TMC2130-TA-T; Mouser Part Number: 700-TMC2130-TA-T; Mouser Price/Stock: https://www.mouser.co.uk/ProductDetail/Trinamic/TMC2130-TA-T?qs=TiOZkKH1s2SorQX5NhxZsQ%3D%3D

## Nets that join several sheets
Net0.47nF_X_1: Stepper Motor Driver Board (X-Driver.6), X_Axis Stepper Motor Driver (13 pins)
Net0.47nF_X_2: Stepper Motor Driver Board (X-Driver.2), X_Axis Stepper Motor Driver (25 pins)
Net0.47nF_Z_1: Stepper Motor Driver Board (Z-Driver.6), Z-Axis Stepper Motor Driver (13 pins)
Net0.47nF_Z_2: Stepper Motor Driver Board (Z-Driver.2), Z-Axis Stepper Motor Driver (25 pins)
Net0.47uF_E_1: Stepper Motor Driver Board (E-Driver.6), Extruder Stepper Motor Driver (13 pins)
Net0.47uF_E_2: Stepper Motor Driver Board (E-Driver.2), Extruder Stepper Motor Driver (25 pins)
Net10k_Dr_Enb_E_2: Stepper Motor Driver Board (E-Driver.1), Extruder Stepper Motor Driver (10k_Dr_Enb_E.2 E-Axis_SMIC.29)
Net10k_Dr_Enb_X_2: Stepper Motor Driver Board (X-Driver.1), X_Axis Stepper Motor Driver (10k_Dr_Enb_X.2 X-Axis_SMIC.29)
Net10k_Dr_Enb_Z_2: Stepper Motor Driver Board (Z-Driver.1), Z-Axis Stepper Motor Driver (10k_Dr_Enb_Z.2 Z-Axis_SMIC.29)
Net100nF_1_E_2: Stepper Motor Driver Board (E-Driver.3), Extruder Stepper Motor Driver (8 pins)
Net100nF_1_X_2: Stepper Motor Driver Board (X-Driver.3), X_Axis Stepper Motor Driver (8 pins)
Net100nF_1_Z_2: Stepper Motor Driver Board (Z-Driver.3), Z-Axis Stepper Motor Driver (8 pins)
NetE-Axis_SMIC_8: Stepper Motor Driver Board (E-Driver.5), Extruder Stepper Motor Driver (E-Axis_SMIC.8)
NetE-Axis_SMIC_9: Stepper Motor Driver Board (E-Driver.4), Extruder Stepper Motor Driver (E-Axis_SMIC.9)
NetE-Axis_SMIC_15: Stepper Motor Driver Board (E-Stepper_Motor.4), Extruder Stepper Motor Driver (E-Axis_SMIC.15)
NetE-Axis_SMIC_19: Stepper Motor Driver Board (E-Stepper_Motor.2), Extruder Stepper Motor Driver (E-Axis_SMIC.19)
NetE-Axis_SMIC_42: Stepper Motor Driver Board (E-Stepper_Motor.3), Extruder Stepper Motor Driver (E-Axis_SMIC.42)
NetE-Axis_SMIC_46: Stepper Motor Driver Board (E-Stepper_Motor.1), Extruder Stepper Motor Driver (E-Axis_SMIC.46)
NetX-Axis_SMIC_8: Stepper Motor Driver Board (X-Driver.5), X_Axis Stepper Motor Driver (X-Axis_SMIC.8)
NetX-Axis_SMIC_9: Stepper Motor Driver Board (X-Driver.4), X_Axis Stepper Motor Driver (X-Axis_SMIC.9)
NetX-Axis_SMIC_15: Stepper Motor Driver Board (X-Stepper_Motor.4), X_Axis Stepper Motor Driver (X-Axis_SMIC.15)
NetX-Axis_SMIC_19: Stepper Motor Driver Board (X-Stepper_Motor.2), X_Axis Stepper Motor Driver (X-Axis_SMIC.19)
NetX-Axis_SMIC_42: Stepper Motor Driver Board (X-Stepper_Motor.3), X_Axis Stepper Motor Driver (X-Axis_SMIC.42)
NetX-Axis_SMIC_46: Stepper Motor Driver Board (X-Stepper_Motor.1), X_Axis Stepper Motor Driver (X-Axis_SMIC.46)
NetZ-Axis_SMIC_8: Stepper Motor Driver Board (Z-Driver.5), Z-Axis Stepper Motor Driver (Z-Axis_SMIC.8)
NetZ-Axis_SMIC_9: Stepper Motor Driver Board (Z-Driver.4), Z-Axis Stepper Motor Driver (Z-Axis_SMIC.9)
NetZ-Axis_SMIC_15: Stepper Motor Driver Board (Z-Stepper_Motor.4), Z-Axis Stepper Motor Driver (Z-Axis_SMIC.15)
NetZ-Axis_SMIC_19: Stepper Motor Driver Board (Z-Stepper_Motor.2), Z-Axis Stepper Motor Driver (Z-Axis_SMIC.19)
NetZ-Axis_SMIC_42: Stepper Motor Driver Board (Z-Stepper_Motor.3), Z-Axis Stepper Motor Driver (Z-Axis_SMIC.42)
NetZ-Axis_SMIC_46: Stepper Motor Driver Board (Z-Stepper_Motor.1), Z-Axis Stepper Motor Driver (Z-Axis_SMIC.46)